# EAGLE board ESP32 Display 2.8 inch V1.0 (EAGLE 9.6.2)
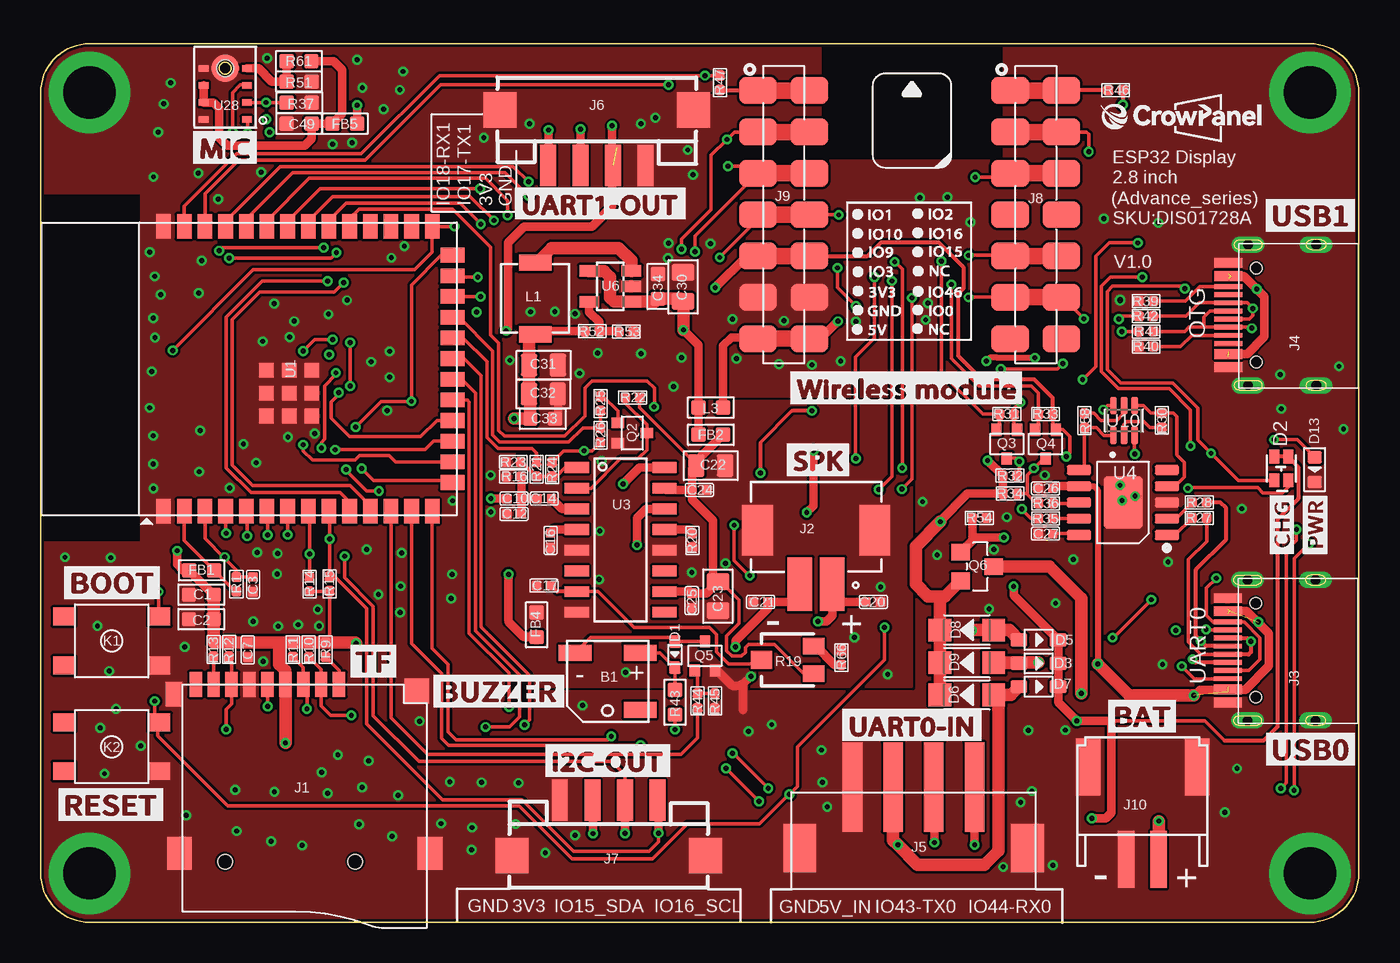
[diagram p5: board, top side]
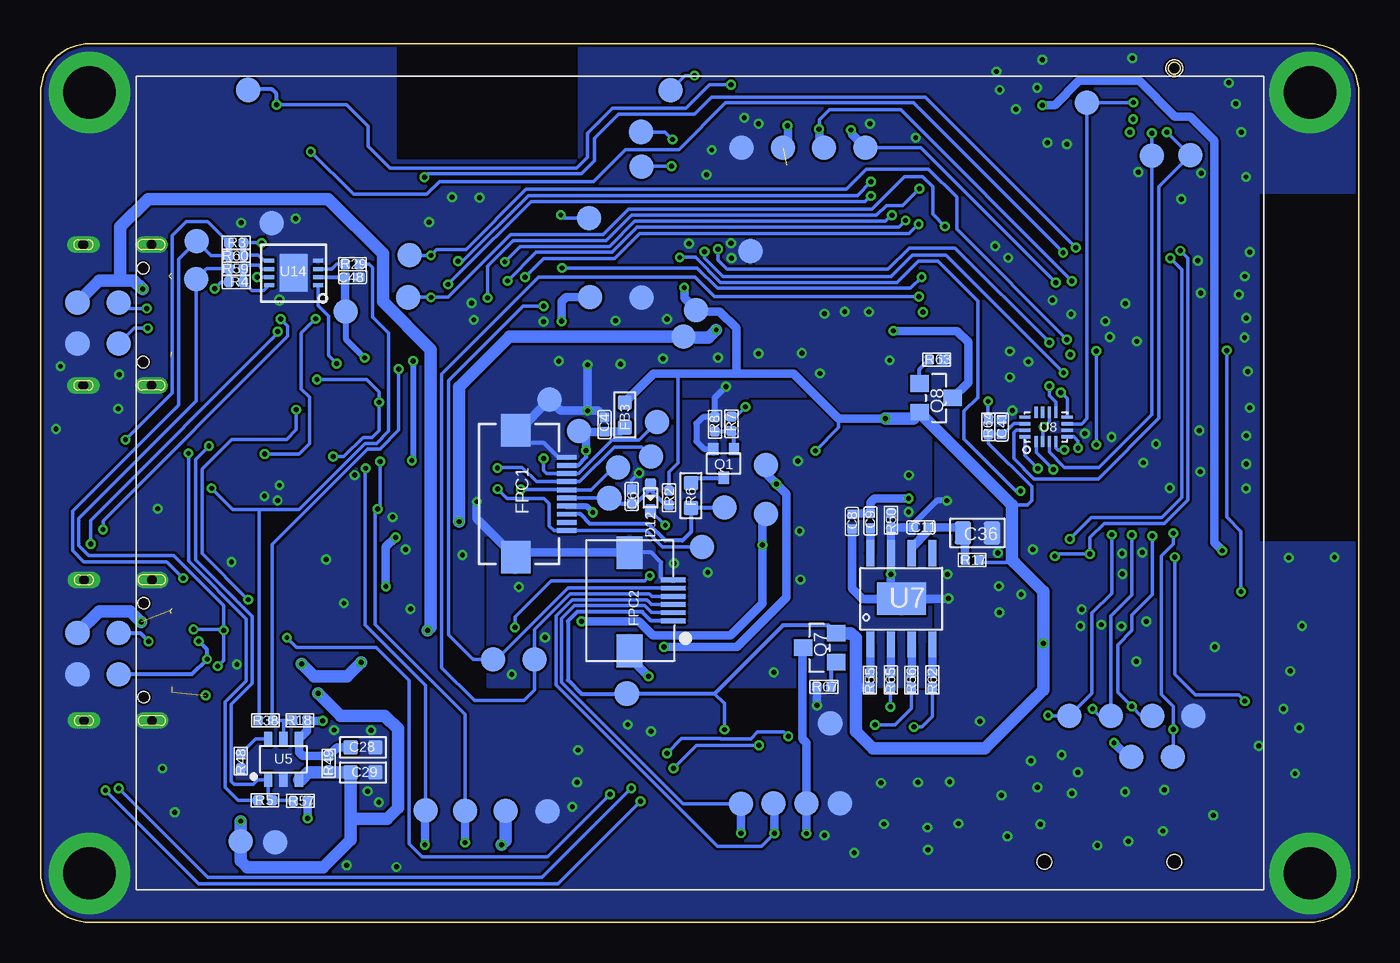
[diagram p6: board, bottom side, seen from below]

Size 81 x 54 mm. Coordinates in mm from the lower left corner, seen from the top.
Outline: 0,51 0,3 arc90 3,0 78,0 arc90 81,3 81,51 arc90 78,54 3,54 arc90 0,51
Copper layers (1*16): Top 0.035mm / dielectric 1.5mm / Bottom 0.035mm
Design rules "default": minimum track width 8mil, minimum drill 0.3mm, track to track 6mil, track to pad 6mil, pad to pad 4mil, via to via 6mil, smd to smd 6mil, copper to edge 6mil, drill to drill 4mil, minimum pad ring 6mil, minimum via ring 6mil, stop-mask expansion 4mil, vias tented up to drill 100mil, thermal gap 0mil
tRestrict: area 0.1,23.4 to 6.1,44.7; area 48,46.9 to 59.1,54
bRestrict: area 0.1,23.4 to 6.1,44.7; area 48,46.9 to 59.1,54

## Footprints (pad centres in the part's own frame; a part is rotated, then mirrored left to right if it is on the bottom)
BEEP_5025 = smd 2 x 1: 1 -2,-1.75; 2 2,-1.75; 3 -2,1.75
C0603 = smd 0.889 x 0.889: 1 -0.762,0; 2 0.762,0
C0402 = smd 0.6 x 0.6: 1 -0.45,0; 2 0.45,0
C0805 = smd 1.016 x 1.397: 1 -0.889,0; 2 0.889,0
D_SOD523 = smd 0.762 x 0.7: + -0.8,0; - 0.8,0
LED_KT-0603RYG = smd 0.85 x 0.6: 1 0.725,-0.425; 2 0.725,0.425; 3 -0.725,-0.425; 4 -0.725,0.425
D_SOD323 = smd 1 x 0.8: + -1.2,0; - 1.2,0
D_SOD123FL = smd 1.397 x 1.397: + -1.651,0; - 1.651,0
LED0603 = smd 0.762 x 0.889: + -0.762,0; - 0.762,0
L0603 = smd 0.889 x 0.889: 1 -0.762,0; 2 0.762,0
FPC-P0.5MM-10P-SMD = smd 0.3 x 1.2: P$1 2.25,-1.574; P$2 1.75,-1.574; P$3 1.25,-1.574; P$4 0.75,-1.574; P$5 0.25,-1.574; P$6 -0.25,-1.574; P$7 -0.75,-1.574; P$8 -1.25,-1.574; P$9 -1.75,-1.574; P$10 -2.25,-1.574 | smd 2 x 1.8: P$11 3.9,1.576; P$12 -3.9,1.576
FPC-6PIN-0.5MM_2 = smd 0.3 x 1.5: 1 1.183,2.184; 2 0.683,2.184; 3 0.183,2.184; 4 -0.317,2.184; 5 -0.817,2.184; 6 -1.317,2.184 | smd 2 x 1.6: 7 -3.01,-0.496; 8 3.036,-0.496
9P-SMD-W/-RING = smd 1.524 x 0.762: 1 0,4.4; 2 0,3.3; 3 0,2.2; 4 0,1.1; 5 0,0; 6 0,-1.1; 7 0,-2.2; 8 0,-3.3; 9 0,-4.4 | smd 1.524 x 1.016: G1 0.6,-5.746 | smd 2.032 x 1.524: G2 10.373,-5.4; G3 10.373,10 | smd 1.524 x 1.524: G4 0.392,9.181 | hole 0.889: 10.9,-2.6; 10.9,5.4
CONN-TH_2P-P2.00_XUNPU_WAFER-PH2.0-2PLB = smd 1.5 x 3.3: 1 -1,1.65; 2 1,1.65 | smd 1.9 x 3.1: 3 3.6,-1.65; 4 -3.6,-1.65
USB-3.0TYPEC-SMD = smd 0.3 x 1.7: A1 -3.35,0.5; A4 -2.55,0.5; A5 -1.25,0.5; A6 -0.25,0.5; A7 0.25,0.5; A8 1.25,0.5; A9 2.55,0.5; A12 3.35,0.5; B1 3.05,0.5; B4 2.25,0.5; B5 1.75,0.5; B6 0.75,0.5; B7 -0.75,0.5; B8 -1.75,0.5; B9 -2.25,0.5; B12 -3.05,0.5 | drill 0.6 pad 1.016 long: P$1 -4.325,-0.72; P$2 4.325,-0.72; P$3 -4.325,-4.9; P$4 4.325,-4.9 | hole 0.68: -2.89,-1.22; 2.89,-1.22
XH2.54-4P-SMD = smd 1.2 x 5.5: 1 -3.75,-1.875; 2 -1.25,-1.875; 3 1.25,-1.875; 4 3.75,-1.875 | smd 2 x 3: 5 -7,1.875; 6 7,1.875
CONNECTOR_4P-SMD-2.0 = smd 0.965 x 2.54: 1 -3,0; 2 -1,0; 3 1,0; 4 3,0 | smd 2.032 x 2.184: SS1 -5.946,3.4; SS2 5.946,3.4
H7-2.54-18.28X2.5X5MM = smd 1.65 x 2.3: 1 -7.62,-1.58; 1-1 -7.62,1.58; 2 -5.08,-1.58; 2-2 -5.08,1.58; 3 -2.54,-1.58; 3-3 -2.54,1.58; 4 0,-1.58; 4-4 0,1.58; 5 2.54,-1.58; 5-5 2.54,1.58; 6 5.08,-1.58; 6-6 5.08,1.58; 7 7.62,-1.58; 7-7 7.62,1.58
PH2.0WT-2PIN = smd 1 x 3.5: P$1 -1,0; P$2 1,0 | smd 1.5 x 3.5: P$3 -3.35,-5.7; P$4 3.35,-5.7
THO-M3.2*5MM-HOLE = drill 3.2 pad 5: P$1 0,0
KEY-4.5X4.5-SMD = smd 1.35 x 1.1: 1 -2.925,1.5; 2 -2.925,-1.5; 3 2.925,-1.5; 4 2.925,1.5
L0420 = smd 2 x 1: 1 0,2.2; 2 0,-2.2
TEST_PAD-1.5MM = smd 1.5 x 1.5: P$1 0,0
MOS_SOT323 = smd 0.635 x 0.762: 1 -0.635,-0.889; 2 0.635,-0.889; 3 0,0.889
PMOS_SOT23 = smd 1.016 x 1.143: 1 -0.889,-1.016; 2 0.889,-1.016; 3 0,1.016
R0402 = smd 0.635 x 0.635: 1 -0.445,0; 2 0.445,0
R0603-SP = smd 0.889 x 0.889: 1 -0.762,0; 2 0.762,0
3P-SMD-SQUA-3.6X3.3 = smd 1 x 1.3: 1 -0.85,-1.6; 3 0.85,-1.6 | smd 1.1 x 1.3: 2 0,1.6
ESP32-S3-WROOM-1-SMD41 = smd 1.5 x 0.9: 1 -8.75,5.26; 2 -8.75,3.99; 3 -8.75,2.72; 4 -8.75,1.45; 5 -8.75,0.18; 6 -8.75,-1.09; 7 -8.75,-2.36; 8 -8.75,-3.63; 9 -8.75,-4.9; 10 -8.75,-6.17; 11 -8.75,-7.44; 12 -8.75,-8.71; 13 -8.75,-9.98; 14 -8.75,-11.25; 27 8.75,-11.25; 28 8.75,-9.98; 29 8.75,-8.71; 30 8.75,-7.44; 31 8.75,-6.17; 32 8.75,-4.9; 33 8.75,-3.63; 34 8.75,-2.36; 35 8.75,-1.09; 36 8.75,0.18; 37 8.75,1.45; 38 8.75,2.72; 39 8.75,3.99; 40 8.75,5.26 | smd 0.9 x 1.5: 15 -6.985,-12.5; 16 -5.715,-12.5; 17 -4.445,-12.5; 18 -3.175,-12.5; 19 -1.905,-12.5; 20 -0.635,-12.5; 21 0.635,-12.5; 22 1.905,-12.5; 23 3.175,-12.5; 24 4.445,-12.5; 25 5.715,-12.5; 26 6.985,-12.5 | smd 0.9 x 0.9: 41 -2.9,-1.06; 42 -1.5,-1.06; 43 -0.1,-1.06; 44 -2.9,-2.46; 45 -1.5,-2.46; 46 -0.1,-2.46; 47 -2.9,-3.86; 48 -1.5,-3.86; 49 -0.1,-3.86
SOP-16 = smd 0.66 x 1.5: 1 -4.445,-2.7; 2 -3.175,-2.7; 3 -1.905,-2.7; 4 -0.635,-2.7; 5 0.635,-2.7; 6 1.905,-2.7; 7 3.175,-2.7; 8 4.445,-2.7; 9 4.445,2.7; 10 3.175,2.7; 11 1.905,2.7; 12 0.635,2.7; 13 -0.635,2.7; 14 -1.905,2.7; 15 -3.175,2.7; 16 -4.445,2.7
ESOP-10-EP-150MIL = smd 1.5 x 0.6: 1 -2.7,2; 2 -2.7,1; 3 -2.7,0; 4 -2.7,-1; 5 -2.7,-2; 6 2.7,-2; 7 2.7,-1; 8 2.7,0; 9 2.7,1; 10 2.7,2 | smd 2.4 x 3.2: EP 0,0
SOT23-6L = smd 0.5 x 0.9: 1 -0.961,-1.212; 2 -0.011,-1.212; 3 0.94,-1.212; 4 0.94,1.288; 5 -0.011,1.288; 6 -0.961,1.288
IC_SOT23-5 = smd 0.69 x 1.2: 1 -0.95,-1.3; 2 0,-1.3; 3 0.95,-1.3; 4 0.95,1.3; 5 -0.95,1.3
NS4168-ESOP-8 = smd 1.6 x 0.5: 1 -2.8,1.905; 2 -2.8,0.635; 3 -2.8,-0.635; 4 -2.8,-1.905; 5 2.8,-1.905; 6 2.8,-0.635; 7 2.8,0.635; 8 2.8,1.905 | smd 2 x 3: 9 0,0
IC_SGM3799_TQFN2.6X1.8_16L = smd 0.2 x 0.7: 1 -0.6,-0.9; 2 -0.2,-0.9; 3 0.2,-0.9; 4 0.6,-0.9; 9 0.6,0.9; 10 0.2,0.9; 11 -0.2,0.9; 12 -0.6,0.9 | smd 0.7 x 0.2: 5 1.3,-0.6; 6 1.3,-0.2; 7 1.3,0.2; 8 1.3,0.6; 13 -1.3,0.6; 14 -1.3,0.2; 15 -1.3,-0.2; 16 -1.3,-0.6
SOP65P210X100-6N = smd 1.09 x 0.4: 1 -0.92,0.65; 2 -0.92,0; 3 -0.92,-0.65; 4 0.92,-0.65; 5 0.92,0; 6 0.92,0.65
DFN8 = smd 0.61 x 0.25: 1 -1.5,0.75; 2 -1.5,0.25; 3 -1.5,-0.25; 4 -1.5,-0.75; 5 1.5,-0.75; 6 1.5,-0.25; 7 1.5,0.25; 8 1.5,0.75 | smd 1.7 x 2.3: P$9 0,0
ICS_43432_IIS_INMP441 = smd 0.6 x 0.4: 1 1.203,-0.991; 2 1.203,0.059; 3 1.203,1.109; 4 1.203,2.159; 6 -1.457,2.159; 7 -1.457,1.109; 8 -1.457,0.059; 9 -1.457,-0.991 | smd 1.7 x 1.7: 5 -0.127,2.159 | hole 1: -0.127,2.159

## Placement (x,y rotation side)
B1  BEEP_5025  [BEEP_5025]  34.84,14.81 180 top
C1  10uF/0603  [C0603]  9.88,20.13 0 top
C2  100nF/0603  [C0603]  9.87,18.63 0 top
C3  1uF  [C0402]  13.05,20.78 90 top
C4  100nF  [C0402]  46.35,30.59 270 bottom
C6  1uF  [C0402]  44.68,26.17 270 bottom
C7  1uF  [C0402]  12.73,16.74 90 top
C8  1nF  [C0402]  31.14,24.63 90 bottom
C9  10uF  [C0402]  30.01,24.67 90 bottom
C10  1uF  [C0402]  29.09,26.04 180 top
C11  100nF  [C0402]  26.92,24.28 180 bottom
C12  NC/100nF  [C0402]  29.09,25.1 0 top
C14  100nF  [C0402]  30.95,26.04 180 top
C16  4.7uF  [C0402]  31.33,23.48 90 top
C17  100nF  [C0402]  30.92,20.69 0 top
C20  1nF  [C0402]  51.17,19.69 180 top
C21  1nF  [C0402]  44.24,19.69 0 top
C22  22uF/0805  [C0805]  41.17,28.07 180 top
C23  22uF/0805  [C0805]  41.62,20.05 90 top
C24  100nF  [C0402]  40.48,26.58 0 top
C25  100nF  [C0402]  40.01,19.77 270 top
C26  1uF  [C0402]  61.75,26.67 0 top
C27  1uF  [C0402]  61.75,23.89 0 top
C28  1uF/0603  [C0603]  61.2,10.75 180 bottom
C29  10uF/0603  [C0603]  61.19,9.21 180 bottom
C30  22uF/0805  [C0805]  39.47,39.05 270 top
C31  22uF/0805  [C0805]  30.9,34.25 180 top
C32  22uF/0805  [C0805]  30.89,32.48 180 top
C33  1uF/0603  [C0603]  30.85,30.95 180 top
C34  1uF/0603  [C0603]  37.93,39.08 270 top
C36  47uF/0805  [C0805]  23.43,23.93 0 bottom
C41  1uF  [C0402]  21.95,30.45 270 bottom
C48  1uF  [C0402]  61.84,39.65 180 bottom
C49  100nF  [C0603]  15.88,49.09 0 top
D1  B5819WT  [D_SOD523]  38.97,16.45 270 top
D2  KT-0603RYG  [LED_KT-0603RYG]  76.23,27.89 90 top
D3  1N5817WS  [D_SOD323]  61.32,15.91 0 top
D5  1N5817WS  [D_SOD323]  61.32,17.36 0 top
D6  DSS34  [D_SOD123FL]  56.91,13.97 180 top
D7  1N5817WS  [D_SOD323]  61.32,14.48 0 top
D8  DSS34  [D_SOD123FL]  56.91,17.96 180 top
D9  DSS34  [D_SOD123FL]  56.91,15.95 180 top
D12  B5819WT  [D_SOD523]  43.53,26.08 270 bottom
D13  Red  [LED0603]  78.29,27.82 270 top
FB1  0R/800mA  [L0603]  9.89,21.63 0 top
FB2  0R/600mA  [L0603]  41.18,29.97 0 top
FB3  0R/800mA  [L0603]  45.11,31.18 270 bottom
FB4  0R/600mA  [L0603]  30.47,18.29 270 top
FB5  0R/800mA  [L0603]  18.69,49.09 180 top
FPC1  TFT-2.4/2.8LCD-SPI-10P  [FPC-P0.5MM-10P-SMD]  50.23,26.33 90 bottom
FPC2  FPC-6PIN-0.5MMFPC-6PIN-0.5MM_2  [FPC-6PIN-0.5MM_2]  44.31,19.72 270 bottom
J1  [9P-SMD-W/-RING]  13.93,14.62 270 top
J2  WAFER-PH2.0-2PLB  [CONN-TH_2P-P2.00_XUNPU_WAFER-PH2.0-2PLB]  47.65,22.43 180 top
J3  TYPEC-3.0-16P-SMD  [USB-3.0TYPEC-SMD]  73.45,16.72 90 top
J4  TYPEC-3.0-16P-SMD  [USB-3.0TYPEC-SMD]  73.48,37.32 90 top
J5  XH2.54-4P-SMT  [XH2.54-4P-SMD]  53.63,6.44 180 top
J6  HY2.0-4P-SMT  [CONNECTOR_4P-SMD-2.0]  34.17,46.52 0 top
J7  HY2.0-4P-SMT  [CONNECTOR_4P-SMD-2.0]  34.91,7.51 180 top
J8  [H7-2.54-18.28X2.5X5MM]  61.15,43.49 270 top
J9  [H7-2.54-18.28X2.5X5MM]  45.66,43.49 270 top
J10  PH2.0WT-2PIN  [PH2.0WT-2PIN]  67.7,3.86 180 top
J12  THO-M3.25MM-HOLE  [THO-M3.2*5MM-HOLE]  3,3 0 bottom
J13  THO-M3.25MM-HOLE  [THO-M3.2*5MM-HOLE]  78,3 0 top
J14  THO-M3.25MM-HOLE  [THO-M3.2*5MM-HOLE]  78,51 0 top
J15  THO-M3.25MM-HOLE  [THO-M3.2*5MM-HOLE]  3,51 0 top
K1  KEY-4.5X4.5  [KEY-4.5X4.5-SMD]  4.36,17.29 180 top
K2  KEY-4.5X4.5  [KEY-4.5X4.5-SMD]  4.36,10.79 180 top
L1  4.7uH/3A  [L0420]  30.38,38.34 0 top
L3  NC  [L0603]  41.18,31.64 180 top
P1  TEST_PADPAD-1.5MM  [TEST_PAD-1.5MM]  44.98,14.05 270 bottom
P2  TEST_PADPAD-1.5MM  [TEST_PAD-1.5MM]  35.96,7.3 270 bottom
P3  TEST_PADPAD-1.5MM  [TEST_PAD-1.5MM]  37.96,7.27 270 bottom
P4  TEST_PADPAD-1.5MM  [TEST_PAD-1.5MM]  50.66,16.17 90 bottom
P5  TEST_PADPAD-1.5MM  [TEST_PAD-1.5MM]  53.2,16.17 90 bottom
P6  TEST_PADPAD-1.5MM  [TEST_PAD-1.5MM]  32.48,12.21 270 bottom
P7  TEST_PADPAD-1.5MM  [TEST_PAD-1.5MM]  47.92,30.19 0 bottom
P8  TEST_PADPAD-1.5MM  [TEST_PAD-1.5MM]  46.06,26.06 0 bottom
P9  TEST_PADPAD-1.5MM  [TEST_PAD-1.5MM]  43.49,28.62 0 bottom
P10  TEST_PADPAD-1.5MM  [TEST_PAD-1.5MM]  40.36,23.07 0 bottom
P11  TEST_PADPAD-1.5MM  [TEST_PAD-1.5MM]  45.52,27.95 0 bottom
P12  TEST_PADPAD-1.5MM  [TEST_PAD-1.5MM]  43.12,30.75 0 bottom
P13  TEST_PADPAD-1.5MM  [TEST_PAD-1.5MM]  47.3,43.29 180 bottom
P14  TEST_PADPAD-1.5MM  [TEST_PAD-1.5MM]  44.07,46.43 180 bottom
P15  TEST_PADPAD-1.5MM  [TEST_PAD-1.5MM]  38.99,25.5 0 bottom
P16  TEST_PADPAD-1.5MM  [TEST_PAD-1.5MM]  49.72,32.12 0 bottom
P17  TEST_PADPAD-1.5MM  [TEST_PAD-1.5MM]  13.97,10.16 0 bottom
P18  TEST_PADPAD-1.5MM  [TEST_PAD-1.5MM]  33.94,7.31 0 bottom
P19  TEST_PADPAD-1.5MM  [TEST_PAD-1.5MM]  17.78,12.7 0 bottom
P20  TEST_PADPAD-1.5MM  [TEST_PAD-1.5MM]  15.24,12.7 0 bottom
P21  TEST_PADPAD-1.5MM  [TEST_PAD-1.5MM]  12.7,12.7 0 bottom
P22  TEST_PADPAD-1.5MM  [TEST_PAD-1.5MM]  11.43,10.16 0 bottom
P23  TEST_PADPAD-1.5MM  [TEST_PAD-1.5MM]  44.1,48.58 180 bottom
P24  TEST_PADPAD-1.5MM  [TEST_PAD-1.5MM]  10.16,12.7 0 bottom
P25  TEST_PADPAD-1.5MM  [TEST_PAD-1.5MM]  71.44,39.53 0 bottom
P26  TEST_PADPAD-1.5MM  [TEST_PAD-1.5MM]  16.7,50.37 0 bottom
P27  TEST_PADPAD-1.5MM  [TEST_PAD-1.5MM]  12.73,47.13 0 bottom
P28  TEST_PADPAD-1.5MM  [TEST_PAD-1.5MM]  36.42,28.12 0 bottom
P29  TEST_PADPAD-1.5MM  [TEST_PAD-1.5MM]  10.36,47.14 0 bottom
P30  TEST_PADPAD-1.5MM  [TEST_PAD-1.5MM]  36.42,25.1 0 bottom
P31  TEST_PADPAD-1.5MM  [TEST_PAD-1.5MM]  58.42,38.41 180 bottom
P32  TEST_PADPAD-1.5MM  [TEST_PAD-1.5MM]  58.34,41 180 bottom
P34  TEST_PADPAD-1.5MM  [TEST_PAD-1.5MM]  31.9,7.31 0 bottom
P36  TEST_PADPAD-1.5MM  [TEST_PAD-1.5MM]  35.4,47.61 0 bottom
P37  TEST_PADPAD-1.5MM  [TEST_PAD-1.5MM]  37.94,47.61 0 bottom
P38  TEST_PADPAD-1.5MM  [TEST_PAD-1.5MM]  32.86,47.61 0 bottom
P39  TEST_PADPAD-1.5MM  [TEST_PAD-1.5MM]  30.32,47.61 0 bottom
P40  TEST_PADPAD-1.5MM  [TEST_PAD-1.5MM]  52.42,6.84 0 bottom
P41  TEST_PADPAD-1.5MM  [TEST_PAD-1.5MM]  49.85,6.83 0 bottom
P42  TEST_PADPAD-1.5MM  [TEST_PAD-1.5MM]  54.92,6.86 0 bottom
P43  TEST_PADPAD-1.5MM  [TEST_PAD-1.5MM]  57.34,6.88 0 bottom
P44  TEST_PADPAD-1.5MM  [TEST_PAD-1.5MM]  78.74,38.1 0 bottom
P45  TEST_PADPAD-1.5MM  [TEST_PAD-1.5MM]  76.2,35.56 0 bottom
P46  TEST_PADPAD-1.5MM  [TEST_PAD-1.5MM]  76.2,38.1 0 bottom
P47  TEST_PADPAD-1.5MM  [TEST_PAD-1.5MM]  78.74,35.56 0 bottom
P48  TEST_PADPAD-1.5MM  [TEST_PAD-1.5MM]  78.74,17.78 0 bottom
P49  TEST_PADPAD-1.5MM  [TEST_PAD-1.5MM]  76.2,17.78 0 bottom
P50  TEST_PADPAD-1.5MM  [TEST_PAD-1.5MM]  76.2,15.24 0 bottom
P51  TEST_PADPAD-1.5MM  [TEST_PAD-1.5MM]  78.74,15.24 0 bottom
P52  TEST_PADPAD-1.5MM  [TEST_PAD-1.5MM]  68.72,4.97 0 bottom
P53  TEST_PADPAD-1.5MM  [TEST_PAD-1.5MM]  66.58,4.91 0 bottom
P54  TEST_PADPAD-1.5MM  [TEST_PAD-1.5MM]  41.5,35.99 0 bottom
P55  TEST_PADPAD-1.5MM  [TEST_PAD-1.5MM]  37.38,41.25 0 bottom
P58  TEST_PADPAD-1.5MM  [TEST_PAD-1.5MM]  68.26,51.16 0 bottom
P59  TEST_PADPAD-1.5MM  [TEST_PAD-1.5MM]  42.3,51.13 0 bottom
P60  TEST_PADPAD-1.5MM  [TEST_PAD-1.5MM]  44.07,38.4 0 bottom
P61  TEST_PADPAD-1.5MM  [TEST_PAD-1.5MM]  40.73,37.63 0 bottom
P62  TEST_PADPAD-1.5MM  [TEST_PAD-1.5MM]  47.23,38.43 0 bottom
P74  TEST_PADPAD-1.5MM  [TEST_PAD-1.5MM]  62.26,37.55 0 bottom
P78  TEST_PADPAD-1.5MM  [TEST_PAD-1.5MM]  71.41,41.86 0 bottom
P79  TEST_PADPAD-1.5MM  [TEST_PAD-1.5MM]  66.81,42.97 0 bottom
Q1  SS8050W-SOT323  [MOS_SOT323]  39.03,28.2 180 bottom
Q2  BSS138W_SOT323  [MOS_SOT323]  36.36,30.07 270 top
Q3  BSS138W_SOT323  [MOS_SOT323]  59.37,29.39 180 top
Q4  BSS138W_SOT323  [MOS_SOT323]  61.75,29.39 180 top
Q5  SS8050W-SOT323  [MOS_SOT323]  40.82,16.37 0 top
Q6  AO3401  [PMOS_SOT23]  57.55,21.87 270 top
Q7  AO3401  [PMOS_SOT23]  33.13,16.87 90 bottom
Q8  AO3401  [PMOS_SOT23]  25.98,32.22 270 bottom
R1  10K  [R0402]  12.03,20.78 270 top
R2  10K  [R0402]  42.39,26.09 90 bottom
R3  5.1K 1%  [R0402]  68.99,41.76 0 bottom
R4  5.1K  [R0402]  68.99,39.36 180 bottom
R5  NC  [R0402]  67.21,7.5 180 bottom
R6  6.8R/0603  [R0603-SP]  41.04,26.23 270 bottom
R7  1K  [R0402]  38.55,30.64 90 bottom
R8  47K  [R0402]  39.57,30.61 90 bottom
R9  10K  [R0402]  17.51,16.75 90 top
R10  10K  [R0402]  16.48,16.75 90 top
R11  10K  [R0402]  15.5,16.76 90 top
R12  10K  [R0402]  11.57,16.77 90 top
R13  10K  [R0402]  10.62,16.77 90 top
R14  4.7k  [R0402]  16.52,20.77 270 top
R15  4.7k  [R0402]  17.75,20.79 270 top
R16  4.7k  [R0402]  29.06,27.39 0 top
R17  0R  [R0402]  23.76,22.26 180 bottom
R18  5.1K  [R0402]  65.07,12.41 180 bottom
R19  10K  [3P-SMD-SQUA-3.6X3.3]  45.9,16.13 90 top
R20  47K  [R0402]  40.04,23.46 90 top
R21  1K  [R0402]  30.47,27.84 90 top
R22  10K  [R0402]  36.36,32.25 0 top
R23  NC  [R0402]  29.05,28.29 0 top
R24  10K  [R0402]  31.42,27.83 90 top
R25  1K  [R0402]  34.4,31.88 270 top
R26  10K  [R0402]  34.4,29.94 270 top
R27  0R  [R0402]  71.2,24.85 0 top
R28  0R  [R0402]  71.2,25.8 0 top
R29  2K  [R0402]  61.84,40.46 0 bottom
R30  10K  [R0402]  68.9,30.86 90 top
R31  4.7k  [R0402]  59.37,31.23 0 top
R32  4.7k  [R0402]  59.56,27.45 180 top
R33  4.7k  [R0402]  61.75,31.23 0 top
R34  4.7k  [R0402]  59.57,26.34 180 top
R35  0R  [R0402]  61.75,24.82 0 top
R36  0R  [R0402]  61.75,25.75 0 top
R37  4.7K  [R0603-SP]  15.89,50.38 0 top
R38  NC  [R0402]  67.18,12.4 180 bottom
R39  5.1K  [R0402]  67.93,38.18 0 top
R40  5.1K  [R0402]  67.93,35.38 0 top
R41  0R  [R0402]  67.93,36.31 0 top
R42  0R  [R0402]  67.92,37.25 0 top
R43  3.9R/0603  [R0603-SP]  38.98,13.53 270 top
R44  1K  [R0402]  40.36,13.61 270 top
R45  47K  [R0402]  41.42,13.61 270 top
R46  0R  [R0402]  66.05,51.14 0 top
R47  0R  [R0402]  41.74,51.6 90 top
R48  2K  [R0402]  68.7,9.91 90 bottom
R49  5.1K  [R0402]  63.31,9.77 90 bottom
R50  0R  [R0402]  28.74,24.71 270 bottom
R51  0R  [R0603-SP]  15.88,51.67 180 top
R52  45.3K  [R0402]  33.9,36.32 180 top
R53  10K  [R0402]  35.98,36.29 180 top
R54  10K 1%  [R0402]  57.69,24.86 180 top
R55  100k  [R0402]  30.03,14.89 270 bottom
R56  0R  [R0402]  27.49,14.88 270 bottom
R57  5.1K  [R0402]  65.04,7.45 180 bottom
R58  10K  [R0402]  64.14,30.84 270 top
R59  0R  [R0402]  68.98,40.16 0 bottom
R60  0R  [R0402]  68.99,40.96 0 bottom
R61  NC/0R  [R0603-SP]  15.87,52.93 0 top
R62  0R  [R0402]  26.2,14.9 270 bottom
R63  10K  [R0402]  25.95,34.59 180 bottom
R64  10K  [R0402]  22.76,30.46 270 bottom
R65  0R  [R0402]  28.76,14.89 270 bottom
R66  2K  [R0402]  49.2,16.27 270 top
R67  10K  [R0402]  32.86,14.46 0 bottom
U1  ESP32-S3-WROOM-1  [ESP32-S3-WROOM-1-SMD41]  12.81,34.02 90 top
U3  NS4268-SOP16  [SOP-16]  35.63,23.5 270 top
U4  CH340K  [ESOP-10-EP-150MIL]  66.51,25.8 180 top
U5  TP4059-SOT23-6  [SOT23-6L]  66.07,9.98 0 bottom
U6  RY3420  [IC_SOT23-5]  35,39.09 90 top
U7  NS4168-ESOP-8  [NS4168-ESOP-8]  28.11,19.88 90 bottom
U8  SGM3799  [IC_SGM3799_TQFN2.6X1.8_16L]  19.22,30.45 0 bottom
U10  UMH3NTN  [SOP65P210X100-6N]  66.57,30.84 90 top
U14  STC8G1K08  [DFN8]  65.45,39.91 180 bottom
U28  ICS_43432_IIS_INMP441  [ICS_43432_IIS_INMP441]  11.48,50.33 0 top

## Tracks (layer width: path | path; a pad name or v marks a point on that pad's centre or on a via)
3V3  (via drill 0.3)
  Top 0.203: Q3.1 59.81,30.47 R31.2 59.81,31.56 v60.21,31.96 | R33.2 62.19,30.47 Q4.1 62.83,30.28 63.24,29.87 63.24,28.84 v63.02,28.62 | R14.2 17.73,20.33 R15.2 17.75,17.43 R9.2 | R43.2 38.98,11.85 v38.99,11.84 | R24.2 32.13,28.98 v33.39,28.98 33.88,28.98 R26.2 | v67.43,41.76 65.66,41.76 64.83,40.93 64.83,34.16 v64.03,33.36
  Top 0.254: J9.5-5 50.81,40.95 51.65,41.79 55.18,41.79 56.69,40.28 56.69,38.94 56.37,38.62 56.37,34.83 57.84,33.36 61.06,33.36 62.19,32.23 R33.2
  Top 0.508: L1.2 30.56,36.32 R52.2 | J1.4 15.03,15.47 | C1.2 FB1.1 8.74,21.63 8.38,21.99 v8.38,22.84 | v41.45,39.01 43.39,40.95 J9.5 | FB5.1 v19.45,50.23
  Top 0.762: L1.2 30.36,36.14 30.01,35.79 C31.2 C32.2 30.09,32.39 C33.2 29.1,30.95 v29.09,30.96 | v15.04,11.03 J1.4 | 15.03,15.47 14.64,15.86 14.64,17.19 | 14.64,17.19 C7.2 12.71,17.21 R12.2 R13.2 10.62,18.62 C2.2 C1.2 | 14.64,17.19 R11.2 16.47,17.2 R10.2 R9.2 19.33,17.19 v19.39,17.13
  Top 1.016: J9.5 J9.5-5
  Bottom 0.203: v63.02,28.62 62.38,28.62 61.2,29.8 60.63,29.8 60.21,30.22 v60.21,31.96 60.21,32.59 60.98,33.36 v64.03,33.36 | U8.14 21.2,30.65 21.85,30 C41.2 21.96,30.01 R64.2 22.76,29.44 20.1,26.78 20.1,25.93 20.37,25.66 21.32,25.66 | R17.1 23.16,22.11 21.17,22.11 | 30.89,14.44 30.91,14.42 | v38.99,11.84 38.99,13.45 39.6,14.05 | v33.39,28.98 31.97,30.4 31.97,30.96 | R2.2 42.39,27.67 41.84,28.22 41.84,33.72 | R3.2 v67.43,41.76
  Bottom 0.254: FPC2.1 43.49,18.53 44.04,19.08 48.04,19.08 48.6,18.52 48.6,14.89 47.76,14.05 P1.P$1 39.6,14.05 35.39,18.26 32.62,18.26 Q7.2
  Bottom 0.508: P17.P$1 14.17,10.16 v15.04,11.03 | R55.2 30.89,14.44 | v41.45,39.01 41.45,38.36 P61.P$1 40.63,37.54 39.28,37.54 38.25,36.51 38.25,33.72 | FB3.1 43.33,33.72 41.84,33.72 38.25,33.72 | v29.09,30.96 31.97,30.96 34.73,33.72 38.25,33.72 | v19.45,50.23 18.67,50.23 17.19,51.71 13.5,51.71 11.3,49.51 10.35,49.51 8.88,48.04 8.88,23.34 v8.38,22.84
  Bottom 0.762: v29.09,30.96 27.37,30.96 Q8.2 21.32,25.66 21.32,22.26 21.17,22.11 19.39,20.33 v19.39,17.13 19.39,14.28 22.98,10.69 29.86,10.69 30.91,11.74 30.91,14.42 30.91,17.47 31.2,17.76 Q7.2
3V3_1
  Top 0.508: R61.2 17.99,52.93 18.52,52.4 18.52,49.68 FB5.2 C49.2 16.65,48.16 16.23,47.74 11.45,47.74 10.98,48.21 10.98,50.03 10.62,50.39 U28.8 U28.7
3V3_OUT1  (via drill 0.3)  (1 unrouted)
  Top 0.508: v28.6,36.35 28.73,36.48 28.73,41.78 29.71,42.76 33.88,42.76 35.12,44 v35.12,48.95
  Bottom 0.508: Q8.3 24,33.18 24,35.66 24.69,36.35 v28.6,36.35 | v35.12,48.95 35.08,48.91 35.08,47.93 P36.P$1
3V3_OUT2  (via drill 0.3)
  Top 0.508: v33.94,5.45 33.94,7.47 J7.3
  Bottom 0.508: Q7.3 34.19,16.83 34.19,11.27 33.94,11.02 P18.P$1 v33.94,5.45
+5V_IN  (via drill 0.3)
  Top 0.762: D7.+ 59.61,13.97 D6.+ 58.85,13.68 58.85,4.41 57.98,3.54 53.89,3.54 v52.67,4.75 52.38,5.05 J5.3
  Bottom 0.762: P40.P$1 52.42,5 v52.67,4.75
+VBUS1  (via drill 0.3)  (5 unrouted)
  Top 0.381: U4.7 64.73,26.8 64.96,26.57 v64.96,15.88
  Top 0.508: 73.08,19.14 74.08,19.14 75.47,17.75 75.47,15.75 74.01,14.29 71.22,14.29 v70.87,13.95 | C26.2 62.33,26.8 U4.7
  Top 0.762: D3.+ 60.08,15.95 D9.+ 58.59,15.98 v61.31,15.98 | v64.96,15.88 66.89,13.95 v70.87,13.95
  Bottom 0.762: P48.P$1 77.41,19.11 75.5,19.11 74.84,18.45 v74.83,18.45 | v64.96,15.88 64.19,15.11 62.18,15.11 v61.31,15.98
+VBUS2  (via drill 0.3)  (4 unrouted)
  Top 0.508: 73.13,39.72 73.93,39.72 v74.74,38.91 75.2,38.45 75.2,35.99 74.14,34.93 72.99,34.93 | 57.25,17.96 v57.22,17.93
  Top 0.762: D5.+ 59.52,17.96 D8.+ 57.25,17.96
  Bottom 0.762: P44.P$1 77.39,39.45 76.1,39.45 | v74.74,38.91 75.28,39.45 76.1,39.45 | v57.22,17.93 57.04,18.11 57.04,34.58 57.04,35.22 59.97,38.14 59.97,41.09 63.34,44.46 74.4,44.46 76.1,42.76 76.1,39.45
+VC_IN  (via drill 0.3)
  Top 0.203: 72.75,11.16 71.54,12.37 65.78,12.37
  Top 0.254: D2.2 D2.1 77.28,28 77.28,26.03 76,24.75 76,12.02 75.14,11.16 72.75,11.16
  Top 0.508: R54.2 57.24,23.47 | 57.24,23.47 Q6.1 | v59.2,23.65 57.42,23.65 57.24,23.47 | v64.59,6.4 65.45,6.4 65.78,6.73 65.78,12.37 v63.66,12.37 62.52,13.51 D7.- D3.- D5.- 59.79,20.09 v59.79,20.64
  Bottom 0.203: v64.59,6.4 | 64.58,12.37 R18.1
  Bottom 0.508: 63.38,10.14 R49.2 | C28.2 62.77,10.75 R49.2 | R49.2 64.89,10.21 65.13,10.45 U5.4 64.62,11.78 R18.1 | R57.1 v64.59,6.4 | v63.66,12.37 64.58,12.37 | v59.79,20.64 59.79,23.06 v59.2,23.65
A_GND  (via drill 0.3)
  other vias: 34.36,24.04 34.32,21.06 40.01,21.51 35.95,15.35 50.01,17.51 52.05,15.24 51.62,20.62 34.47,28.35 27.65,27.48 27.66,25.22 42.08,22.05
  pour Top: 27.05,32 27.05,14.5 53.5,14.5 53.5,32
  pour Bottom: 26.33,32 26.33,14.5 53.5,14.5 53.5,32
AOUT_R  (via drill 0.3)
  Top 0.508: C10.2 v27.66,26.04
  Bottom 0.508: v27.66,26.04 29.76,26.04 30.01,25.79 C9.2 31.09,25.12 C8.2
AVCC_AMP
  Top 0.203: R22.2 36.81,31.63 40.28,28.16 C22.2 | 41.7,21.02 42.91,19.81 42.91,18.37 42.14,17.6 42.14,16.69 42.47,16.36 43.06,16.36 43.3,16.6 43.3,16.9 43.49,17.09 45.09,17.09 46.9,15.28 R19.1
  Top 0.508: FB2.2 40.28,28.31 40.28,28.16 40.03,27.9 C24.1 | U3.15 38.43,26.58 C24.1 | C24.1 40.03,25.99 41.33,24.69 41.33,21.23 C23.2 | 41.7,21.02 C23.2 | C23.2 40.9,20.22 C25.1 39.9,20.33 U3.10
C_LED
  Bottom 0.203: U14.8 67.28,38.83 68.01,38.83 R4.1
CH_EN  (via drill 0.3)
  Top 0.203: U1.3 10.09,23.59 11.28,22.41 | 11.28,22.41 12.03,21.65 R1.1 C3.2 | K2.2 7.2,12.37 | 7.2,12.37 7,12.58 v7,13.59 | 11.28,22.41 v11.31,22.44 | U10.6 65.55,31.76 v65.29,31.5 | 7.2,12.37 7.2,11.45 11.49,7.16 29.4,7.16 32.66,3.9 37.61,3.9 39.76,6.05 44.17,6.05 45.99,7.87 v46.01,7.87 46.5,8.36 46.5,10.78 51.86,16.14 v51.86,18.13 | v42.62,24.41 42.62,22.25 v43.57,21.3 | v68.25,19.82 65.91,17.49 v65.87,17.49
  Bottom 0.203: v11.31,22.44 11.31,15.24 10.04,13.97 7.38,13.97 v7,13.59 | v65.29,31.5 65.29,30.28 65.9,29.67 69.26,29.67 71.08,27.85 71.08,22.66 v68.25,19.82 | v46.01,7.87 49.85,4.03 57.57,4.03 58.37,4.83 58.37,14.87 60.39,16.89 65.27,16.89 v65.87,17.49 | D12.- 42.65,24.41 v42.62,24.41 | v43.57,21.3 43.89,20.98 49.64,20.98 51.86,18.76 v51.86,18.13
CHRG  (via drill 0.3)
  Top 0.203: v67.7,39.66 65.74,39.66 65.19,39.11 65.19,33.83 66.23,32.79 69.35,32.79 70.66,31.48 v70.66,29.28
  Bottom 0.203: v70.66,29.28 v70.66,29.27 71.48,28.45 71.48,22.27 68,18.8 68,14.68 69.29,13.39 69.29,8.66 69.12,8.49 67.93,8.49 67.68,8.74 67.03,8.74 | U14.7 v67.7,39.66 | R57.2 65.52,7.5 R5.1 67.03,7.76 67.03,8.74 | 67.03,8.74 U5.1
D_LED
  Bottom 0.203: U14.3 63.11,40.16 62.81,40.45 R29.1
DA1
  Top 0.203: J1.8 10.63,16.31 R13.1
DA2
  Top 0.203: R9.1 18.33,15.48 J1.1
DONE  (via drill 0.3)
  Top 0.203: v59,34.01 62.49,34.01 v62.82,34.34
  Bottom 0.203: v59,34.01 59,30.24 60.16,29.08 60.9,29.08 66.78,23.21 66.78,12.41 R38.1 | v62.82,34.34 63.32,34.84 63.32,37.27 63.95,37.9 U14.1 | R18.2 66.09,12.41 | 66.09,12.41 66.65,12.41 R38.1 | R38.1 | U5.5 66.08,12.4 66.09,12.41
DTR
  Top 0.203: U4.4 69.71,26.8 70.28,27.37 70.28,28.27 69.83,28.72 69.83,31.07 69.6,31.3 R30.2 68.21,31.3 67.75,31.76 U10.4
ESP_3V3
  Top 0.203: U1.2 8.82,23.46 FB1.2 11.96,20.33 R1.2
ESP_D+  (via drill 0.3)
  Top 0.203: U1.14 24.06,16.83 25.04,15.85 25.04,11.7 25.52,11.22 34.86,11.22 v35.06,11.42 | R42.1 66.44,37.25 v66.26,37.07 | v77.17,24.15 77.17,23.46 76.55,22.84 76.55,8.58 v76.21,8.24 | v44.71,8.24 42.56,10.39 v42.52,10.39
  Bottom 0.203: v66.26,37.07 65.83,36.64 65.83,36.02 77.17,24.68 v77.17,24.15 | v76.21,8.24 70.73,2.76 50.19,2.76 v44.71,8.24 | v42.52,10.39 41.62,11.29 39.23,11.29 39.22,11.28 37.37,11.28 36.96,11.69 35.33,11.69 v35.06,11.42
ESP_D-  (via drill 0.3)
  Top 0.203: U1.13 22.79,17.15 24.63,15.31 24.63,11.3 25.07,10.86 36.85,10.86 v36.87,10.88 | v42.12,9.46 v44.14,7.44 | v77.02,8.1 77.02,22.35 v77.93,23.26 | v66.43,36.31 v66.44,36.31 R41.1
  Bottom 0.203: v36.87,10.88 40.7,10.88 v42.12,9.46 | v44.14,7.44 49.2,2.38 71.3,2.38 v77.02,8.1 | v77.93,23.26 77.93,24.7 66.43,36.2 v66.43,36.31
ESP_RXD0  (via drill 0.3)
  Top 0.203: Q4.2 61.3,30.47 R33.1 61.3,32.54 60.87,32.97 58.36,32.97 58.35,32.96 57.65,32.96 55.97,34.64 v55.97,39.21 | U1.36 12.63,43.22 15.5,46.09 28.54,46.09 v29.98,44.64
  Bottom 0.203: v55.97,39.21 55.35,39.83 50.88,44.3 30.34,44.3 30,44.64 v29.98,44.64
ESP_RXD1  (via drill 0.3)
  Top 0.203: v18.61,39.31 18.04,38.74 13.46,38.74 11.77,37.05 11.77,28.09 13.02,26.84 19.02,26.84 20.25,25.61 U1.11
  Top 0.508: J6.1 31.2,46.55 v31.2,48.7
  Bottom 0.203: P39.P$1 26.91,47.61 v18.61,39.31
  Bottom 0.508: v31.2,48.7 31.15,48.65 31.15,48.44 P39.P$1
ESP_RXD2  (via drill 0.3)
  Top 0.203: U1.38 10.09,44.79 12.16,46.85 19.93,46.85 24.57,51.49 38.49,51.49 v38.59,51.49
  Top 0.254: R46.2 v66.5,50.25
  Bottom 0.203: v38.59,51.49 39.89,51.49 41.33,50.05 45.86,50.05 47.41,48.5 47.41,47.01 48.06,46.36 59.54,46.36 60.88,47.7 60.88,48.93 62.2,50.25 v66.5,50.25
  Bottom 0.254: v66.5,50.25 66.5,50.92 66.78,51.2 68.21,51.2 P58.P$1
ESP_TXD0  (via drill 0.3)
  Top 0.203: Q3.2 58.92,30.47 R31.1 57.9,31.23 55.36,33.77 v55.36,40.63 | U1.37 11.36,43.08 14.73,46.45 29.04,46.45 v29.98,45.51
  Bottom 0.203: v55.36,40.63 55.06,40.63 51.02,44.66 30.82,44.66 v29.98,45.51
ESP_TXD1  (via drill 0.3)
  Top 0.203: U1.10 18.98,25.83 18.4,26.41 12.92,26.41 11.41,27.92 11.41,37.2 13.62,39.41 v17.63,39.41
  Top 0.508: v33.18,48.75 J6.2
  Bottom 0.203: v17.63,39.41 28.15,49.93 32.53,49.93 33.14,49.32 33.14,48.71 33.14,48.66
  Bottom 0.508: P38.P$1 33.14,47.89 33.14,48.66 | 33.14,48.71 v33.18,48.75
ESP_TXD2  (via drill 0.3)
  Top 0.203: U1.39 8.82,44.02 12.03,47.23 19.7,47.23 24.51,52.04 v40.83,52.04 R47.2
  Bottom 0.203: P59.P$1 41.4,52.04 v40.83,52.04
GND  (via drill 0.3, 0.35)
  Top 0.203: K1.1 7.62,16.12 | v44.23,27.61 44.23,29.5 46.17,31.44 v47.39,31.44 | R40.1
  Top 0.381: 43.17,13.04 43.17,13.77
  Top 0.508: v43.65,15.12 43.17,14.64 | 43.17,14.64 43.17,13.04 | Q5.2 41.55,15.48 42.51,14.53 42.98,14.53 43.09,14.64 43.17,14.64 | C33.1 31.78,31.11 C32.1 | FB4.2 29.68,17.53 28.75,18.46 v28.75,21.39
  Bottom 0.203: C6.1 44.68,27.16 v44.23,27.61
  Bottom 0.254: FPC2.6 42.73,21.03 42.87,21.17 42.87,22.12 43.48,22.73 FPC2.7 | FPC1.P$1 49.18,28.58 50.07,29.47 51.15,29.47 51.81,30.13 FPC1.P$11
  Bottom 0.381: Q1.2 40.24,29.09 40.7,29.55 40.7,30.66 40.31,31.05 R8.2 39.57,32.25 v38.89,32.93 | v25.32,25.91 25.93,25.91 27.37,24.47 C11.2
  Bottom 0.508: C11.2 28.73,24.28 R50.2 U7.7 v28.75,21.39 28.75,20.05 28.91,19.88 | C8.1 31.14,20.52 30.5,19.88 28.91,19.88 | 28.91,19.88 U7.9 25.26,19.88 v25.23,19.91 | v47.39,31.44 v47.39,34.26 | C4.1 46.75,31.44 v47.39,31.44 | v47.39,31.44 49.04,31.44 P16.P$1 51.61,30.23 FPC1.P$11 | FPC2.7 51.51,22.73 FPC1.P$12 54.2,24.82 v54.2,25.85 | FPC2.8 44.8,16.28 v43.65,15.12 | R67.1 v33.3,13.32
  other vias: 55.09,22.57 58.57,22.92 59.38,24.9 25.29,21.39 22.09,19.05 22.11,20.66 38.59,41.74 38.56,40.83 30.1,37.52 31.59,37.54 32.83,37.4 34.23,34.98 33.11,33.74 36.89,34.95 28.83,34.54 42.52,37.08 39.38,34.71 42.76,34.64 45.36,34.32 45.67,36.97 50.09,36.91 27.23,48.22 30.05,49.09 36.88,49.08 37.77,49.45 39.76,47.47 40.08,45.94 41.16,41.71 8.95,6.57 12.04,5.61 11.96,8.15 16.07,4.72 14.36,8.01 14.17,4.98 17.27,9.21 17.63,7.93 18.26,10.29 20.15,9.92 19.75,8.3 19.56,6.02 21.59,5.28 26.48,4.45 26.52,5.82 27.09,8.59 25.14,8.63 24.6,6.07 21.97,7.81 20.03,22.91 23.29,12.36 22.18,22.69 20.75,20.16 6.69,41.2 7,39.7 7.38,38.58 6.91,37.14 7.02,35.94 6.83,33.86 6.69,31.62 6.91,29.9 6.92,28.16 6.93,26.66 3.92,9.14 6.15,10.84 3.66,11.95 4.63,13.12 4.22,15.44 3.49,18.22 1.49,22.44 4.31,22.41 7.99,51.59 7.56,50.3 7.22,48.57 6.93,45.81 9.69,46.04 10.9,44.44 13.54,46.11 17.93,47.83 19.14,47.92 21.08,49.98 19.77,51.29 19.45,53.01 13.92,53.1 22.27,52.29 22.07,51.16 61.71,27.48 58.28,19.26 69.28,22.15 68.94,15.86 16.83,30.03 15.19,29.83 15.29,35.97 15.58,36.94 13.64,35.71 14.35,38.02 17.68,37.37 18.82,38.23 21.45,35.09 20.31,34.45 21.44,33.5 54.52,38.06 54.38,37.03 8.85,16.92 13.05,18.49 13.3,22.74 14.55,22.66 14.52,21.41 14.6,18.2 15.83,18.29 17.03,19.23 17.1,18.22 13.68,16.04 43.49,11.73 44.92,12.15 47.98,10.58 48.05,8.61 48.33,7.1 73.52,9.45 72.76,6.75 54.03,44.54 55.72,44.56 49.16,34.5 65.33,43.25 57.13,43.03 68.69,42.99 79.78,34.17 76.18,33.66 76.24,31.56 80.06,30.32 73.8,25.42 66.33,26.86 67.25,26.19 66.45,25.93 21.28,31.46 66.33,38.24 62.96,11.81 60.7,11.79 60.91,8.06 60.22,7.37 63.46,22.3 62.37,19.61 59.14,3.4 62.21,3.5 31.01,4.28 29.18,6.04 29.37,8.56 32.83,5.35 9.8,30.23 9.73,27.69 12.46,29.39 13.25,28.24 11.62,26.69 9.7,38.68 9.89,40.66 22.35,41.55 21.55,40.84
  pour Bottom (rank 2): -2,55 -2,-2 83,-2 83,55
  pour Top (rank 2): -2,55 -2,-2 83,-2 83,55
IO0_BOOT_BUSY  (via drill 0.3)
  Top 0.203: U10.3 v67.22,28.79 v67.23,28.78 | v25.43,42.77 U1.27 24.06,41.19 22.97,40.1 13.07,40.1 v8.12,35.15 | v7.24,20.32 7.24,18.84 K1.2 | v64.1,37.09 62.78,38.41 J8.6-6 | v57.02,38.41 J8.6
  Top 1.016: J8.6-6 J8.6
  Bottom 0.203: v25.43,42.77 26.18,43.52 26.18,45.21 26.81,45.84 27.91,45.84 29.92,43.83 44.89,43.83 46.46,42.26 52.13,42.26 55.98,38.41 57.27,38.41 | v8.12,35.15 8.12,24.91 7.24,24.03 v7.24,20.32 | v57.02,38.41 P31.P$1 | v67.23,28.78 65.13,28.78 64.48,29.43 64.48,32.27 64.99,32.78 64.99,36.2 v64.1,37.09
  Bottom 0.254: v57.02,38.41 57.27,38.41
IO3  (via drill 0.3)
  Top 0.203: v19.72,27.9 20.46,27.16 25.18,27.16 U1.15
  Bottom 0.203: U8.16 20.52,28.7 v19.72,27.9
IO3_MIC_WS  (via drill 0.3)
  Top 0.203: v11.79,48.56 11.79,51 12.26,51.47 12.64,51.47 U28.3
  Bottom 0.203: U8.15 21.05,30.25 21.2,30.1 21.2,28.49 19.97,27.26 16,27.26 12.28,30.98 12.28,45.22 P29.P$1 10.37,47.14 v11.79,48.56
IO3_W_MOSI  (via drill 0.3)
  Top 0.203: J9.4-4 49.03,43.49 v49.04,43.48 | J9.4 44.08,43.22 v41.73,40.87 | v18.78,27.82 18.78,27.75 20.03,26.5 v20.78,26.5
  Top 1.016: J9.4 J9.4-4
  Bottom 0.203: v49.04,43.48 48.85,43.29 P13.P$1 | v41.73,40.87 40.77,40.87 39.23,39.33 28.39,39.33 27.07,40.65 25.87,40.65 23.41,38.19 23.41,32.26 24.26,31.41 24.26,29.7 21.06,26.5 v20.78,26.5 | U8.1 19.82,28.87 v18.78,27.82
IO4_SD_MISO  (via drill 0.3)
  Top 0.203: U1.4 11.36,23.95 v11.4,23.91 | v11.4,11.85 11.4,13.08 11.73,13.41 J1.7 11.73,16.16 R12.1
  Bottom 0.203: v11.4,23.91 11.4,23.26 12.13,22.53 12.13,14.01 11.4,13.28 v11.4,11.85 11.4,10.19 P22.P$1
IO5_SD_SCK  (via drill 0.3)
  Top 0.203: v13.95,13.26 13.95,14.6 J1.5 | v12.69,23.74 12.69,25.21 U1.5
  Bottom 0.203: P21.P$1 13.39,12.7 v13.95,13.26 14.82,14.13 14.82,17.06 13.95,17.93 13.95,18.9 12.69,20.16 v12.69,23.74
IO6_SD_MOSI  (via drill 0.3)
  Top 0.203: v16.36,13.12 16.36,14.39 J1.3 16.13,15.68 R11.1 | U1.6 13.95,25.22 v13.95,23.8
  Bottom 0.203: v16.36,13.12 15.94,12.7 P20.P$1 15.24,18.84 13.95,20.13 v13.95,23.8
IO7_SD_CS  (via drill 0.3)
  Top 0.203: R10.1 17.23,15.55 J1.2 17.23,13.31 17.83,12.71 v19.09,12.71 | U1.7 v15.17,23.83 v15.18,23.82
  Bottom 0.203: v19.09,12.71 v19.08,12.7 P19.P$1 16.4,14.08 16.4,19 15.18,20.22 v15.18,23.82
IO8_BEEP
  Top 0.203: R44.2 40.36,11.34 39.34,10.32 23.78,10.32 21.52,12.58 U1.12
IO9  (via drill 0.3)
  Top 0.203: v18.09,29.04 18.37,29.04 18.38,29.05 23.63,29.05 24.15,29.57 U1.17
  Bottom 0.203: U8.4 18.62,29.16 18.5,29.04 v18.09,29.04
IO9_MIC_CLK  (via drill 0.3)
  Top 0.203: U28.1 12.72,49.29 v12.72,48.5
  Bottom 0.203: U8.3 19.02,28.89 18.09,27.96 15.97,27.96 12.73,31.2 P27.P$1 v12.72,48.5
IO9_W_MISO  (via drill 0.3)
  Top 0.203: v40.21,41.21 40.21,42.16 J9.3 43.65,46.47 v42.23,46.47 | v18.14,33.77 18.14,33.65 17.44,32.96 17.44,29.69 17.25,29.5 v17.25,29.14
  Top 1.016: J9.3 J9.3-3
  Bottom 0.203: v40.21,41.21 40.21,40.82 39.07,39.68 28.75,39.68 27.42,41.01 25.38,41.01 v18.14,33.77 | v17.25,29.14 17.25,29.57 17.52,29.85 U8.5 | P14.P$1 44.03,46.47 v42.23,46.47
IO10  (via drill 0.3)
  Top 0.203: v18.3,32.56 18.3,32.43 17.85,31.98 17.85,30.99 18.99,29.85 22.95,29.85 23.36,29.85 24.35,30.84 U1.18
  Bottom 0.203: U8.8 17.92,32.18 v18.3,32.55 v18.3,32.56
IO10_MIC_SD  (via drill 0.3)
  Top 0.203: U28.2 v13.85,50.39 R37.1
  Bottom 0.203: U8.7 17.91,30.63 17.03,30.63 16.7,30.96 P26.P$1 16.69,50.39 v13.85,50.39
IO10_W_CLK  (via drill 0.3)
  Top 0.203: J9.2 42.62,48.57 v42.16,48.12 41.2,47.15 41.2,43.8 39.38,41.98 v39.38,41.38 | v19.01,35.62 v19.01,32.95
  Top 1.016: J9.2-2 J9.2
  Bottom 0.203: v39.38,41.38 39.38,40.69 38.82,40.13 28.94,40.13 27.62,41.45 24.81,41.45 19.01,35.65 v19.01,35.62 | v19.01,32.95 19.01,32.37 18.62,31.98 U8.9 | v42.16,48.12 42.63,48.58 P23.P$1
IO11_I2S_LRCLK  (via drill 0.3)
  Top 0.203: U1.19 26.22,32.11 26.34,31.99 26.34,17.76 28.78,15.32 v28.78,13.25
  Bottom 0.203: v28.78,13.25 28.78,14.43 R65.2
IO12_I2S_SDIN  (via drill 0.3)
  Top 0.203: U1.20 25.86,33.38 26.71,32.53 26.71,17.92 29.43,15.2 29.43,12.63 28.8,12 v27.34,12
  Bottom 0.203: v27.34,12 26.85,12 26.2,12.65 R62.2
IO13_I2S_BCLK  (via drill 0.3)
  Top 0.203: v29.73,12.13 30.03,12.43 30.03,15.18 27.07,18.14 27.07,21.02 27.07,21.31 27.07,31.09 27.07,33.61 26.03,34.65 U1.21
  Bottom 0.203: R56.2 27.49,13.16 28.52,12.13 v29.73,12.13
IO14_MUTE
  Top 0.203: R21.2 30.47,28.84 30.19,29.12 28.1,29.12 27.43,29.79 27.43,34.45 25.96,35.92 U1.22
IO15_SDA  (via drill 0.3)
  Top 0.203: R14.1 v16.52,22.64 16.52,25.19 U1.8 | J7.2 35.91,9.05 35.08,9.88 23.24,9.88 20.43,12.69 20.43,19.42 18.67,21.18 v18.67,22.5 | v10.96,41.27 11.16,41.47 v17.38,41.47 | J8.3 59.57,45.98 59.39,45.8 v57.42,45.8
  Top 0.508: J7.2 v35.91,5.47
  Top 1.016: J8.3 J8.3-3
  Bottom 0.203: FPC2.3 43.45,19.53 43.74,19.83 48.34,19.83 49.34,18.82 49.34,14.59 39.41,4.66 36.72,4.66 v35.91,5.47 | v18.67,22.5 18.53,22.64 v16.52,22.64 16.52,23.64 15.64,24.52 11.96,24.52 10.51,25.97 10.51,40.82 v10.96,41.27 | v17.38,41.47 26.63,50.72 39.78,50.72 40.83,49.67 45.49,49.67 46.96,48.2 46.96,46.81 47.77,46 57.22,46 v57.42,45.8
  Bottom 0.508: v35.91,5.47 35.91,7.25 P2.P$1
IO16_SCL  (via drill 0.3)
  Top 0.203: U1.9 17.75,25.23 v17.75,23.57 R15.1 18.09,21.24 20.04,19.29 20.04,12.18 24.7,7.52 29.58,7.52 32.73,4.37 37.39,4.37 37.96,4.94 v37.96,5.48 | v11.59,40.83 17.85,40.83 v18.17,41.15 | v64.4,47.36 64.4,48.43 64.26,48.57 J8.2-2
  Top 0.508: v37.96,5.48 37.96,7.45 J7.1
  Top 1.016: J8.2 J8.2-2
  Bottom 0.203: FPC2.2 43.45,19.03 43.88,19.46 48.2,19.46 48.98,18.68 48.98,14.73 41.52,7.27 P3.P$1 | v11.59,40.83 10.87,40.1 10.87,26.12 12.11,24.88 16.45,24.88 v17.75,23.57 | v18.17,41.15 27.38,50.36 38.92,50.36 41.78,47.5 45.06,47.5 47.04,45.52 56.49,45.52 57.27,44.74 61.78,44.74 v64.4,47.36
  Bottom 0.508: P3.P$1 v37.96,5.48
IO21_SHUT
  Top 0.203: R25.2 R26.1 | R26.1 | U1.23 25.71,37.19 27.78,35.12 27.78,29.94 28.21,29.52 32.45,29.52 33.32,30.39 R26.1
IO38_LED_BK  (via drill 0.3)
  Top 0.203: U1.31 18.98,43.26 19.56,43.84 25.31,43.84 27.65,41.5 27.65,36.08 28.14,35.59 28.14,30.23 28.5,29.87 32.19,29.87 33.44,31.12 33.44,32.85 33.87,33.28 37.26,33.28 37.71,32.83 37.71,31.7 v37.69,31.68
  Bottom 0.203: v37.69,31.68 38.29,31.08 R7.2
IO39_TFT_SDA  (via drill 0.3)
  Top 0.203: U1.32 17.71,43.14 18.78,44.21 25.76,44.21 v27.05,42.92 | v51.23,39.66 51.23,35.9 50.08,34.75 v50.08,28.52 v50.09,28.51
  Bottom 0.203: P12.P$1 44.22,29.65 45.88,29.65 47.95,27.58 FPC1.P$3 49.9,27.58 50.09,27.77 v50.09,28.51 | v27.05,42.92 27.65,42.32 44.2,42.32 45.74,40.78 47.71,40.78 50.11,40.78 v51.23,39.66
IO40_TFT_CS  (via drill 0.3)
  Top 0.203: U1.33 16.44,43.08 17.95,44.59 26.4,44.59 v27.85,43.14 | v52.31,39.42 52.31,27.41 v51.5,26.6
  Bottom 0.203: P11.P$1 45.8,27.95 47.18,26.58 FPC1.P$5 48.68,26.6 v51.5,26.6 | v27.85,43.14 28.27,42.72 44.34,42.72 45.88,41.18 50.55,41.18 v52.31,39.42
IO41_TFT_RS  (via drill 0.3)
  Top 0.203: v53.53,38.38 53.53,27.23 v52.92,26.62 | v27.01,45.09 17.16,45.09 15.17,43.1 U1.34
  Bottom 0.203: P10.P$1 42.78,23.07 43.78,24.08 FPC1.P$10 49.46,24.08 49.75,24.37 49.75,25.73 50.06,26.04 52.34,26.04 v52.92,26.62 | v53.53,38.38 53.53,40.34 51.96,41.91 46.27,41.91 44.7,43.47 29.63,43.47 29.04,44.06 28.04,44.06 v27.01,45.09
IO42_TFT_SCK  (via drill 0.3)
  Top 0.203: v52.94,27.93 52.94,40.13 v52.48,40.59 | v28.7,43.47 28.7,44.36 27.33,45.73 16.51,45.73 13.9,43.12 U1.35
  Bottom 0.203: P9.P$1 44.08,29.21 45.75,29.21 47.88,27.08 FPC1.P$4 50.54,27.08 51.42,27.96 52.91,27.96 v52.94,27.93 | v52.48,40.59 51.53,41.54 46.05,41.54 44.5,43.1 29.07,43.1 v28.7,43.47
IO45_SPISW_ITCHING  (via drill 0.3)
  Top 0.203: U1.26 24.61,41 22.78,39.17 v22.78,32.02 20.93,32.02 v19.36,30.45
  Bottom 0.203: v22.78,32.02 22.78,30.92 R64.1 | U8.2 19.42,30.39 v19.36,30.45 19.02,30.79 U8.10
IO46_W_CS  (via drill 0.3)
  Top 0.203: U1.16 21.8,28.3 21.42,28.68 19.6,28.68 19.33,28.41 16.7,28.41 16.13,28.98 v16.13,29.35 | v16.13,35.1 16.84,35.81 v17.93,35.81 | v57.02,40.99 59.54,40.99 J8.5
  Top 1.016: J8.5 J8.5-5
  Bottom 0.203: v16.13,29.35 v16.13,35.1 | v17.93,35.81 24.71,42.59 24.71,44.56 26.44,46.29 30.26,46.29 31.5,45.05 51.16,45.05 54.86,41.35 56.66,41.35 57.05,40.96 58.3,40.96 P32.P$1
  Bottom 0.254: 57.05,40.96 v57.02,40.99
IO47_TP_INT  (via drill 0.3)
  Top 0.203: U1.24 v27.03,38.46
  Bottom 0.203: FPC2.4 43.44,20.03 43.59,20.18 48.48,20.18 50.66,18.01 P4.P$1 50.66,14.28 51.3,13.64 54.35,13.64 56.36,15.65 56.36,33.7 50.42,39.64 40.78,39.64 39.6,38.46 v27.03,38.46
IO48_TP_RST  (via drill 0.3)
  Top 0.203: v50.1,37.88 48.96,39.01 v48.96,40.22 | v26.86,39.66 25.39,39.66 U1.25
  Bottom 0.203: FPC2.5 42.16,20.56 48.61,20.56 53,16.17 P5.P$1 54.44,16.17 55.93,17.66 55.93,33.29 51.35,37.88 v50.1,37.88 | v48.96,40.22 40.67,40.22 39.42,38.97 27.55,38.97 v26.86,39.66
IOT_5V  (via drill 0.3)
  Top 0.508: J9.7-7 47.93,35.87 v49,36.94 | L3.1 41.94,35.44 42.44,35.94 44.02,35.94 J9.7
  Top 1.016: J9.7-7 J9.7
  Bottom 0.508: v49,36.94 49,38.16 48.73,38.44 P62.P$1
LED_K
  Bottom 0.254: P15.P$1 41.01,25.5 R6.2 41.04,23.98 41.56,23.46 42.62,23.46 43.65,24.49 47.25,24.49 47.84,25.08 FPC1.P$8
MUTE
  Top 0.203: 30.45,27.39 R21.1 | R21.1 31.41,27.39 R24.1 31.66,27.38 32.23,27.95 U3.1 | R21.1 30.15,27.71 30.14,27.71 29.57,28.29 R23.2
N$1
  Bottom 0.254: R6.1 40.72,27.31 Q1.3
N$2  (via drill 0.3)
  Top 0.203: D13.+ 77.21,29.66 v75.79,29.66
  Bottom 0.203: R3.1 70.72,43.05 72.07,43.05 72.93,42.19 72.93,32.78 72.93,32.68 72.93,32.52 v75.79,29.66
N$3
  Bottom 0.254: Q1.1 38.4,30.04 R7.1 39.54,30.19 R8.1
N$4  (via drill 0.3)
  Top 0.203: v70.5,26.68 70.55,26.73 74.78,26.73 75.11,26.4 76.3,26.4 76.66,26.76 D2.3
  Bottom 0.203: v70.5,26.68 69.19,25.37 67.58,25.37 | R29.2 60.8,40.45 60.6,40.25 60.6,37.2 59.61,36.21 59.61,30.18 60.35,29.44 61.05,29.44 65.12,25.37 67.58,25.37 | 67.58,25.37 67.58,12.45 R38.2
N$5  (via drill 0.3)
  Top 0.203: D2.4 73.58,27.17 v71.92,28.83 71.11,29.64 71.11,31.61 69.57,33.15 66.38,33.15 65.54,33.98 65.54,38.77 65.86,39.09 70.18,39.09 v70.32,38.95
  Bottom 0.203: 69.43,39.33 R4.2 69.91,39.36 v70.32,38.95 | v71.92,28.83 71.92,22.21 68.36,18.65 68.36,14.83 69.65,13.54 69.65,8.29 68.86,7.5 R5.2
N$6
  Bottom 0.508: U7.1 30.02,15.35 R55.1
N$7
  Top 0.508: C14.1 32.03,25.41 U3.3
N$8
  Bottom 0.508: U7.2 28.75,15.35 R65.1
N$9
  Top 0.508: R16.2 29.54,27.36 C10.1 | C10.1 C12.2 | C14.2 C10.1
N$10
  Top 0.508: U28.4 13.38,52.49 14.2,51.67 R51.2 15.11,51.68 R61.1
N$11
  Top 0.508: U3.13 39.81,24.14 R20.2
N$12
  Top 0.508: U3.4 31.54,24.14 C16.2
N$13
  Top 0.203: Q2.1 35.47,31.43 34.57,32.33 R25.1
N$14
  Top 0.203: U4.1 69.71,23.8 R27.1
N$15
  Top 0.203: U4.2 69.76,24.8 R28.1
N$16
  Top 0.762: U6.3 36.3,40.66 35.52,41.44 31.4,41.44 30.5,40.54 L1.1
N$17
  Top 0.203: R30.1 68.15,30.42 67.79,30.78 66.76,30.78 66.57,30.59 U10.2
N$18
  Top 0.203: U10.5 66.57,31.29 66.13,30.85 65.15,30.85 64.72,31.29 R58.1
N$19
  Bottom 0.203: R59.2 68.31,40.39 67.61,40.39 67.38,40.16 U14.6
N$20
  Top 0.203: C27.2 63.72,23.89 U4.10
N$21
  Bottom 0.203: U14.5 67.27,40.66 67.63,41.02 68.49,41.02 R60.2
N$22
  Top 0.203: R35.2 63.79,24.82 U4.9
N$23
  Top 0.203: R36.2 63.76,25.75 U4.8
N$24
  Top 0.254: J9.1 41.78,51.11 R47.1
  Top 1.016: J9.1 J9.1-1
N$25
  Top 0.203: R39.2 70.33,38.18 71.22,39.07 J4.B5
N$26
  Top 0.203: J4.A5 70.73,36.07 70.04,35.38 R40.2
N$27
  Top 0.203: Q5.1 40.36,15.3 R44.1 R45.1
N$28
  Top 0.203: B1.2 33.79,17.51 38.71,17.51 D1.+ Q5.3
N$29
  Top 0.203: B1.1 38.06,16.56 D1.- 38.98,15.64 R43.1
N$30
  Top 0.508: R19.3 47.63,16.98 48.78,15.82 R66.2
N$31
  Top 0.508: R53.2 35.5,36.32 R52.1 34.34,36.88 33.7,37.52 U6.5
N$32
  Bottom 0.203: R48.2 67.79,11.27 U5.6
N$36
  Top 0.254: R46.1 62.76,51.14 J8.1-1
  Top 1.016: J8.1 J8.1-1
N$38
  Bottom 0.254: Q8.1 26.99,33.99 R63.2
N$39
  Bottom 0.254: R67.2 32.42,15.68 Q7.1
N$43  (via drill 0.3)
  other vias: 26.79,37.5
N$46
  Bottom 0.508: U7.3 27.48,15.34 R56.1
N$47
  Bottom 0.508: R62.1 U7.4
N$49
  Bottom 0.508: U7.6 27.48,23.04 26.47,24.05 C11.1 24.67,24.28 C36.1 24.2,23.81 R17.2
N$50
  Bottom 0.508: C9.1 U7.8
N$56  (via drill 0.3)
  other vias: 17.72,34.89
N$82  (via drill 0.3)
  other vias: 13.87,49.36
N$83  (via drill 0.3)
  other vias: 14.08,48.57
OTG_D+  (via drill 0.3)
  Top 0.203: R42.2 70.38,37.25 71.2,38.07 J4.B6 74.15,38.07 v74.49,37.73 74.49,37.29 74.27,37.07 J4.A6
  Bottom 0.203: v74.49,37.73 75.83,37.73 P46.P$1
OTG_D-  (via drill 0.3)
  Top 0.203: 71.48,36.57 J4.B7 74.36,36.57 v74.42,36.51 | 71.48,36.57 70.55,36.57 70.3,36.31 R41.2 | J4.A7 71.84,37.57 71.48,37.21 71.48,36.57
  Bottom 0.203: v74.42,36.51 75.25,36.51 P45.P$1
ROUT+  (via drill 0.3)
  Top 0.508: U3.14 37.19,25.41 36.64,24.86 v36.64,23.18 | v47.76,18.49 48.28,18.49 48.65,18.86 J2.1 48.65,20.21 49.17,19.69 C20.2
  Bottom 0.508: v47.76,18.49 44.23,18.49 43.37,17.63 38.62,17.63 36.64,19.61 v36.64,23.18 36.64,24.88 P30.P$1
ROUT-  (via drill 0.3)
  Top 0.508: U3.16 36.79,27.95 v35.78,26.94 | v42.7,16.92 42.7,17.3 44.69,19.29 C21.2 46.18,19.69 46.65,20.16 J2.2
  Bottom 0.508: P28.P$1 36.42,27.58 v35.78,26.94 35.16,26.32 35.16,19.97 38.21,16.92 v42.7,16.92
RTS
  Top 0.203: U10.1 65.35,29.92 64.87,30.39 R58.2 64.14,27.9 64.04,27.8 U4.6
RXD  (via drill 0.3)
  Top 0.203: J3.A5 74.25,15.47 74.93,16.15 74.93,17.49 73.95,18.47 J3.B5 72.03,18.47 71.64,18.86 71.64,20.55 v72.23,21.15
  Bottom 0.203: R60.1 70.52,40.96 P78.P$1 72.52,40.75 72.52,31.78 79.02,25.28 79.02,22.84 78.34,22.16 73.25,22.16 v72.23,21.15
RXD0_H  (via drill 0.3)
  Top 0.203: 60.62,26.28 61.15,25.75 R36.1 | 60.62,26.28 60.56,26.34 R34.1 | Q4.3 61.63,28.5 v61.03,27.91 60.62,27.49 60.62,26.28
  Top 0.508: J5.1 v57.38,4.77 v57.39,4.76
  Bottom 0.203: P43.P$1 57.34,14.56 58.53,15.75 58.79,16.01 61.05,18.27 61.05,27.89 v61.03,27.91
  Bottom 0.508: v57.39,4.76 57.39,6.82 P43.P$1
SHUT
  Top 0.203: R22.1 35.92,31.91 37.25,30.58 Q2.3 37.25,29.04 36.71,28.5 35.63,28.5 33.81,26.68 U3.2
TFT_3V3  (via drill 0.3)
  Top 0.508: v47.07,25.19 47.48,25.6 v47.48,29
  Bottom 0.254: FPC1.P$2 47.99,28.08 47.48,28.59 v47.48,29 | 47.48,29.75 P7.P$1
  Bottom 0.381: FPC1.P$7 47.46,25.58 v47.07,25.19
  Bottom 0.508: v47.48,29 47.48,29.75 | P7.P$1 47.87,30.14 C4.2 46.11,30.14 46.09,30.16 45.37,30.16 FB3.2
TFT_RST
  Bottom 0.203: FPC1.P$6 46.47,26.08 46.26,25.87
  Bottom 0.254: R2.1 42.6,25.64 43.53,26.56 D12.+ 43.53,26.64 44.45,25.72 C6.2 45.72,25.72 P8.P$1 46.26,25.87
TXD  (via drill 0.3)
  Top 0.203: J3.A8 71.63,17.97 v71.61,17.99 | v70.13,15.74 70.9,14.97 J3.B8
  Bottom 0.203: v70.13,15.74 69.76,16.11 v69.76,17.95 | v69.76,17.95 69.76,19.46 72.84,22.54 78.05,22.54 78.66,23.15 78.66,24.81 71.44,32.03 P25.P$1 70.81,40.16 R59.1 | v71.61,17.99 69.8,17.99 v69.76,17.95
TXD0_H  (via drill 0.3)
  Top 0.203: R32.1 60.16,27.6 60.16,28.3 v60.14,28.32 59.94,28.52 59.38,28.52 Q3.3 | v60.3,25.41 60.3,25.36 60.84,24.82 R35.1
  Top 0.508: v54.93,4.9 54.93,8.27 J5.2
  Bottom 0.203: v60.14,28.32 60.14,25.57 v60.3,25.41 60.45,25.26 60.45,18.31 54.92,12.78 P42.P$1
  Bottom 0.508: P42.P$1 v54.92,4.91 v54.93,4.9
USB_D+  (via drill 0.3)
  Top 0.203: R27.2 71.65,23.42 70.53,22.3 70.53,17.22 71.28,16.47 J3.A6
  Top 0.254: J3.B6 74.16,17.47 v74.37,17.26 74.37,16.6 74.22,16.45 72.97,16.45 J3.A6
  Bottom 0.254: P49.P$1 74.89,17.78 v74.37,17.26
USB_D-  (via drill 0.3)
  Top 0.254: R28.2 72.5,25.8 72.85,25.45 72.85,23.54 70.99,21.68 70.99,17.59 v71.3,17.28 71.61,16.97 J3.A7 | J3.B7 70.98,15.97 v70.78,16.17
  Bottom 0.254: v71.3,17.28 70.78,16.76 v70.78,16.17 71.71,15.24 P50.P$1
VBAT  (via drill 0.3)
  Top 0.762: J10.P$1 v68.7,6.21 v68.71,6.22 | Q6.3 61.98,21.87 63.94,19.91 v63.94,14.06
  Bottom 0.203: R49.1 63.19,9.21 C29.2
  Bottom 0.762: v68.71,6.22 68.71,4.98 | 68.71,4.98 P52.P$1 | U5.3 64.99,8.77 64.55,9.21 C29.2 61.96,6.36 | 68.71,4.98 68.71,3.79 68.31,3.39 63.64,3.39 61.96,5.07 61.96,6.36 | v63.94,14.06 62.58,12.7 59.85,12.7 59.04,11.88 59.04,7.02 59.7,6.36 61.96,6.36
VIN  (via drill 0.3)
  Top 0.254: R32.2
  Top 0.381: v61.1,34.69 58.8,34.69 58.79,34.7 58.32,34.7 v58.12,34.5
  Top 0.508: R32.2 R34.2 56.95,26.34 55.28,24.67 v55.28,24.62 | R32.2 v58.19,28.37 | FB2.1 L3.2 40.41,35.49 v39.49,36.41
  Top 0.762: D6.- D9.- D8.- 55.26,20.02 | v55.28,24.62 53.77,23.11 53.77,20.78 54.53,20.02 55.26,20.02 | v39.49,36.41 39.49,38.15 C30.2 39.32,38.32 C34.2 37.74,38.14 U6.1 35.26,38.14 35,38.4 35,39.66 34.62,40.04 U6.4 | 55.26,20.02 55.57,20.02 Q6.2
  Bottom 0.254: U14.2 C48.2
  Bottom 0.381: P74.P$1 62.26,35.85 v61.1,34.69 | v58.12,34.5 58.12,28.44 v58.19,28.37
  Bottom 0.508: P74.P$1 62.28,37.57 C48.2
  Bottom 0.762: v55.28,24.62 55.28,32.91 52.2,35.99 P54.P$1 41.46,35.95 39.95,35.95 v39.49,36.41
VOLU
  Top 0.203: U3.7 34.25,20.33 36.47,18.11 41.11,18.11 41.53,17.69 41.53,16.63 42.27,15.89 44.06,15.89 R19.2
  Top 0.254: U3.7 31.73,20.33 C17.2

## Text on the board
tPlace: ESP32 Display / 2.8 inch | IO18-RX1 | IO17-TX1 | 3V3 | GND | (Advance_series) | SKU:DIS01728A | V1.0 | OTG | + | - | UART0 | + | - | GND | 3V3 | IO15_SDA | IO16_SCL | GND | 5V_IN | IO43-TX0 | IO44-RX0
tNames: J10